# Altium project FULL_2.PrjPCB
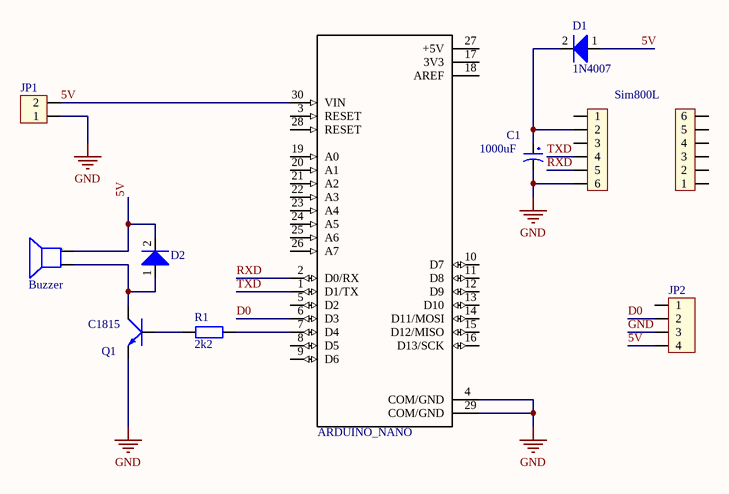
[diagram p0: FULL_2_SCH.SchDoc]
1 sheet, 11 parts. Net scope: global (net labels, ports and power ports of the same name join across sheets).
Board file: FULL_2_PCB.PcbDoc

## Sheet FULL_2_SCH.SchDoc
size A

### Parts
C1  1000uF  [CAP_1000UF_16V]
D1  1N4007  [1N4007]
D2  1N4007  [1N4007]  (value not drawn)
HD2  HD6  [Header_6]  (value not drawn)
JP1  ED2609-ND  [DOMINO_OSTTC_2P]  (value not drawn)
JP2  JP4  [CON4]  (value not drawn)
LS?  Buzzer  [SPEAKER]
Q1  C1815  [QTO-92]
R1  2k2  [R1/4W]
Sim800L  HD6  [Header_6]  (value not drawn)
TB1  ARDUINO_NANO  [*SHIELD_ARDUINO_NANO]

### Nets
GND: C1.2 JP1.1 JP2.3 Q1.1(E) Sim800L.6 TB1.4(COM/GND) TB1.29(COM/GND)
5V: D1.1(A) D2.2(K) JP1.2 JP2.4 LS?.1(+) TB1.30(VIN)
D0: JP2.2 TB1.6(D3)
RXD: Sim800L.5 TB1.2(D0/RX)
TXD: Sim800L.4 TB1.1(D1/TX)
NetC1_1: C1.1 D1.2(K) Sim800L.2
NetD2_1: D2.1(A) LS?.2(-) Q1.2(C)
NetQ1_3: Q1.3(B) R1.1
NetR1_2: R1.2 TB1.7(D4)

Not connected (* = marked no-connect by the designer): HD2 1 2 3 4 5 6; JP2 1; Sim800L 1 3; TB1 3(RESET) 5(D2) 8(D5) 9(D6) 10(D7) 11(D8) 12(D9) 13(D10) 14(D11/MOSI) 15(D12/MISO) 16(D13/SCK) 17(3V3) 18(AREF) 19(A0) 20(A1) 21(A2) 22(A3) 23(A4) 24(A5) 25(A6) 26(A7) 27(+5V) 28(RESET)

### Library data of the parts
C1 = CP4: Cap 1000uF/16V - 220uF/50V; Description 5: 4,7uF>10uF/250V_3,3uF>10uF/400V - 2,2uF>4,7uF/450V; Description 1: 2200uF-3300uF/6,3V - 1000uF-2200uF/10V; Description 2: 1000uF/16V - 470uF => 1000uF/25V - 100uF/100V; Description 3: 330uF>470uF/35V_220uF>470uF/50V_10uF>22uF/250V; Description 4: 220uF => 330uF/63V - 10uF =>33uF/160 - 200V; Value: 1000uF/16V
D1 D2 = 1N4007: Diode LS 1A 1000V DO-41; ComponentLink1Description: Datasheet; ComponentLink1URL: D:\Dropbox\Datasheets\Diodes and Rectifiers\Diodes\1N400X.pdf; Unit Price: 0.0072
HD2 Sim800L = Header6: Header 6; Creat by: VanDungEvn@Gmail.com
JP1 = Con2_1: Connector 2; Value: Connector 2
JP2 = Con4: Connector 4; Value: Connector 4
LS? = Buzz: Buzzer >= 80dB, 5V
Q1 = C1815: NPN 600mW, ECB; Value: C1815
R1 = R1/4W: Resistor 1/4W; Value: R1/4W - 1K
TB1 = ARDUINO_NANO: ATmega4809 Arduino Nano Every with Headers AVRÂ® AVR MCU 8-Bit Embedded Evaluation Board; Availability: Unavailable; Price: None; SnapEDA_Link: https://www.snapeda.com/parts/ARDUINO%20NANO/Arduino/view-part/1128261/?ref=snap; MF: Arduino; Package: None; MP: ARDUINO NANO; Value: *